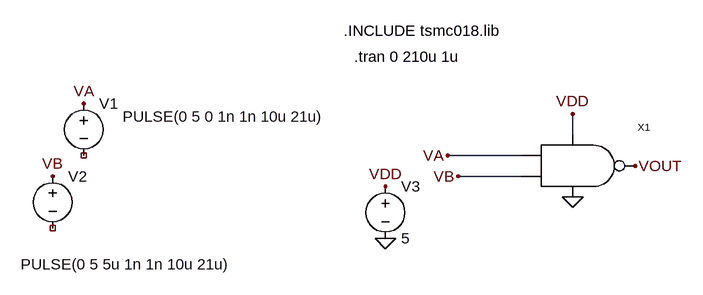
[diagram p0: schematic Exp-5_sim_NAND.asc]
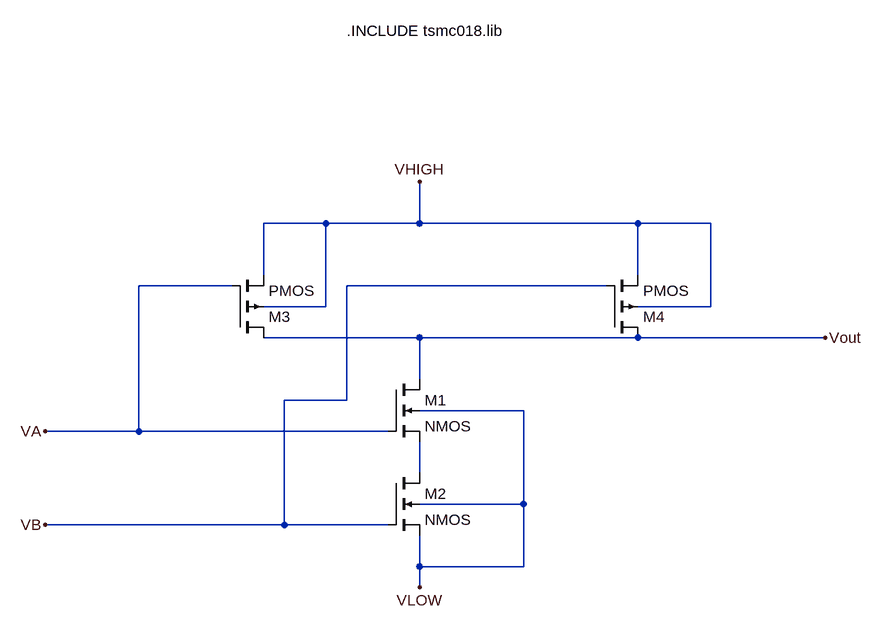
[diagram p1: sub-circuit exp-5.asc]
Exp-5_sim_NAND.asc, the LTspice schematic file:
Version 4
SHEET 1 880 680
WIRE 688 80 688 48
WIRE 608 112 496 112
WIRE 608 144 512 144
FLAG 688 48 VDD
FLAG 400 160 VDD
FLAG 688 176 0
FLAG 400 240 0
FLAG -64 32 VA
FLAG -112 144 VB
FLAG 496 112 VA
FLAG 512 144 VB
FLAG 784 128 VOUT
SYMBOL Exp-5 640 128 R0
SYMATTR InstName X1
SYMBOL voltage -64 16 R0
WINDOW 3 60 36 Left 2
WINDOW 123 0 0 Left 0
WINDOW 39 0 0 Left 0
SYMATTR InstName V1
SYMATTR Value PULSE(0 5 0 1n 1n 10u 21u)
SYMBOL voltage -112 128 R0
WINDOW 3 -49 152 Left 2
WINDOW 123 0 0 Left 0
WINDOW 39 0 0 Left 0
SYMATTR InstName V2
SYMATTR Value PULSE(0 5 5u 1n 1n 10u 21u)
SYMBOL voltage 400 144 R0
WINDOW 123 0 0 Left 0
WINDOW 39 0 0 Left 0
SYMATTR InstName V3
SYMATTR Value 5
TEXT 336 -80 Left 2 !.INCLUDE tsmc018.lib
TEXT 352 -40 Left 2 !.tran 0 210u 1u

exp-5.asc, the sub-circuit schematic file:
Version 4
SHEET 1 880 740
WIRE -16 64 -112 64
WIRE 128 64 128 0
WIRE 128 64 -16 64
WIRE 464 64 128 64
WIRE 576 64 464 64
WIRE -112 144 -112 64
WIRE 464 144 464 64
WIRE -160 160 -304 160
WIRE 416 160 16 160
WIRE -16 192 -16 64
WIRE -16 192 -112 192
WIRE 576 192 576 64
WIRE 576 192 464 192
WIRE 128 240 -112 240
WIRE 464 240 128 240
WIRE 752 240 464 240
WIRE 128 304 128 240
WIRE 16 336 16 160
WIRE 16 336 -80 336
WIRE 288 352 128 352
WIRE -304 384 -304 160
WIRE -304 384 -448 384
WIRE 80 384 -304 384
WIRE 128 448 128 400
WIRE 288 496 288 352
WIRE 288 496 128 496
WIRE -80 528 -80 336
WIRE -80 528 -448 528
WIRE 80 528 -80 528
WIRE 128 592 128 544
WIRE 288 592 288 496
WIRE 288 592 128 592
WIRE 128 624 128 592
FLAG 128 0 VHIGH
FLAG 128 624 VLOW
FLAG -448 384 VA
FLAG -448 528 VB
FLAG 752 240 Vout
SYMBOL nmos4 80 304 R0
SYMATTR InstName M1
SYMATTR Value2 l=180n w=400n
SYMBOL nmos4 80 448 R0
SYMATTR InstName M2
SYMATTR Value2 l=180n w=400n
SYMBOL pmos4 -160 240 M180
SYMATTR InstName M3
SYMATTR Value2 l=180n w=800n
SYMBOL pmos4 416 240 M180
SYMATTR InstName M4
SYMATTR Value2 l=180n w=800n
TEXT 16 -232 Left 2 !.INCLUDE tsmc018.lib

The netlist it stands for:
* Exp-5_sim_NAND.asc
XX1 VDD 0 VA VB VOUT exp-5
V1 VA NC_01 PULSE(0 5 0 1n 1n 10u 21u)
V2 VB NC_02 PULSE(0 5 5u 1n 1n 10u 21u)
V3 VDD 0 5

* block symbol definitions
.subckt exp-5 VHIGH VLOW VA VB VOUT
M1 Vout VA N001 VLOW NMOS l=180n w=400n
M2 N001 VB VLOW VLOW NMOS l=180n w=400n
M3 Vout VA VHIGH VHIGH PMOS l=180n w=800n
M4 Vout VB VHIGH VHIGH PMOS l=180n w=800n
.INCLUDE tsmc018.lib
.ends exp-5

.model NMOS NMOS
.model PMOS PMOS
.lib standard.mos
.INCLUDE tsmc018.lib
.tran 0 210u 1u
.backanno
.end